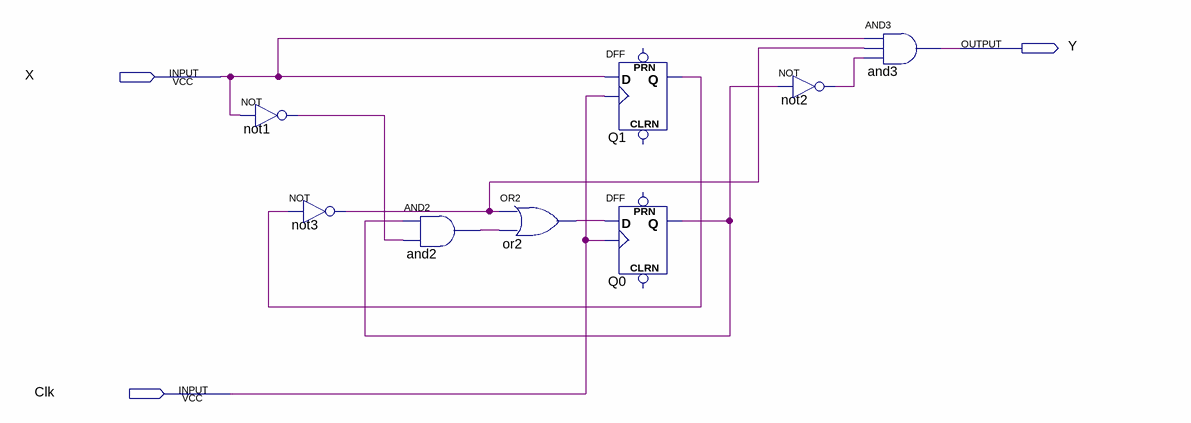
[diagram p0: schematic sheet]
// Quartus schematic SeqDet1101.bdf as structural Verilog: 8 symbols, 3 pins
module SeqDet1101 (
  input  X,
  input  Clk,
  output Y
);

  wire and2_out, not1_out, not2_out, not3_out, or2_out, Q0_q, Q1_q;

  not not1 (not1_out, X);
  not not3 (not3_out, Q1_q);
  and and2 (and2_out, Q0_q, not1_out);
  or or2 (or2_out, not3_out, and2_out);
  DFF Q1 (.CLK(Clk), .D(X), .Q(Q1_q));  // open: CLRN, PRN
  DFF Q0 (.CLK(Clk), .D(or2_out), .Q(Q0_q));  // open: CLRN, PRN
  not not2 (not2_out, Q0_q);
  and and3 (Y, X, not3_out, not2_out);
endmodule
